# EAGLE schematic V0 (EAGLE 9.3.0)

## Sheet 1 of 10: ESP32 + CP2102N/USB + Antenna
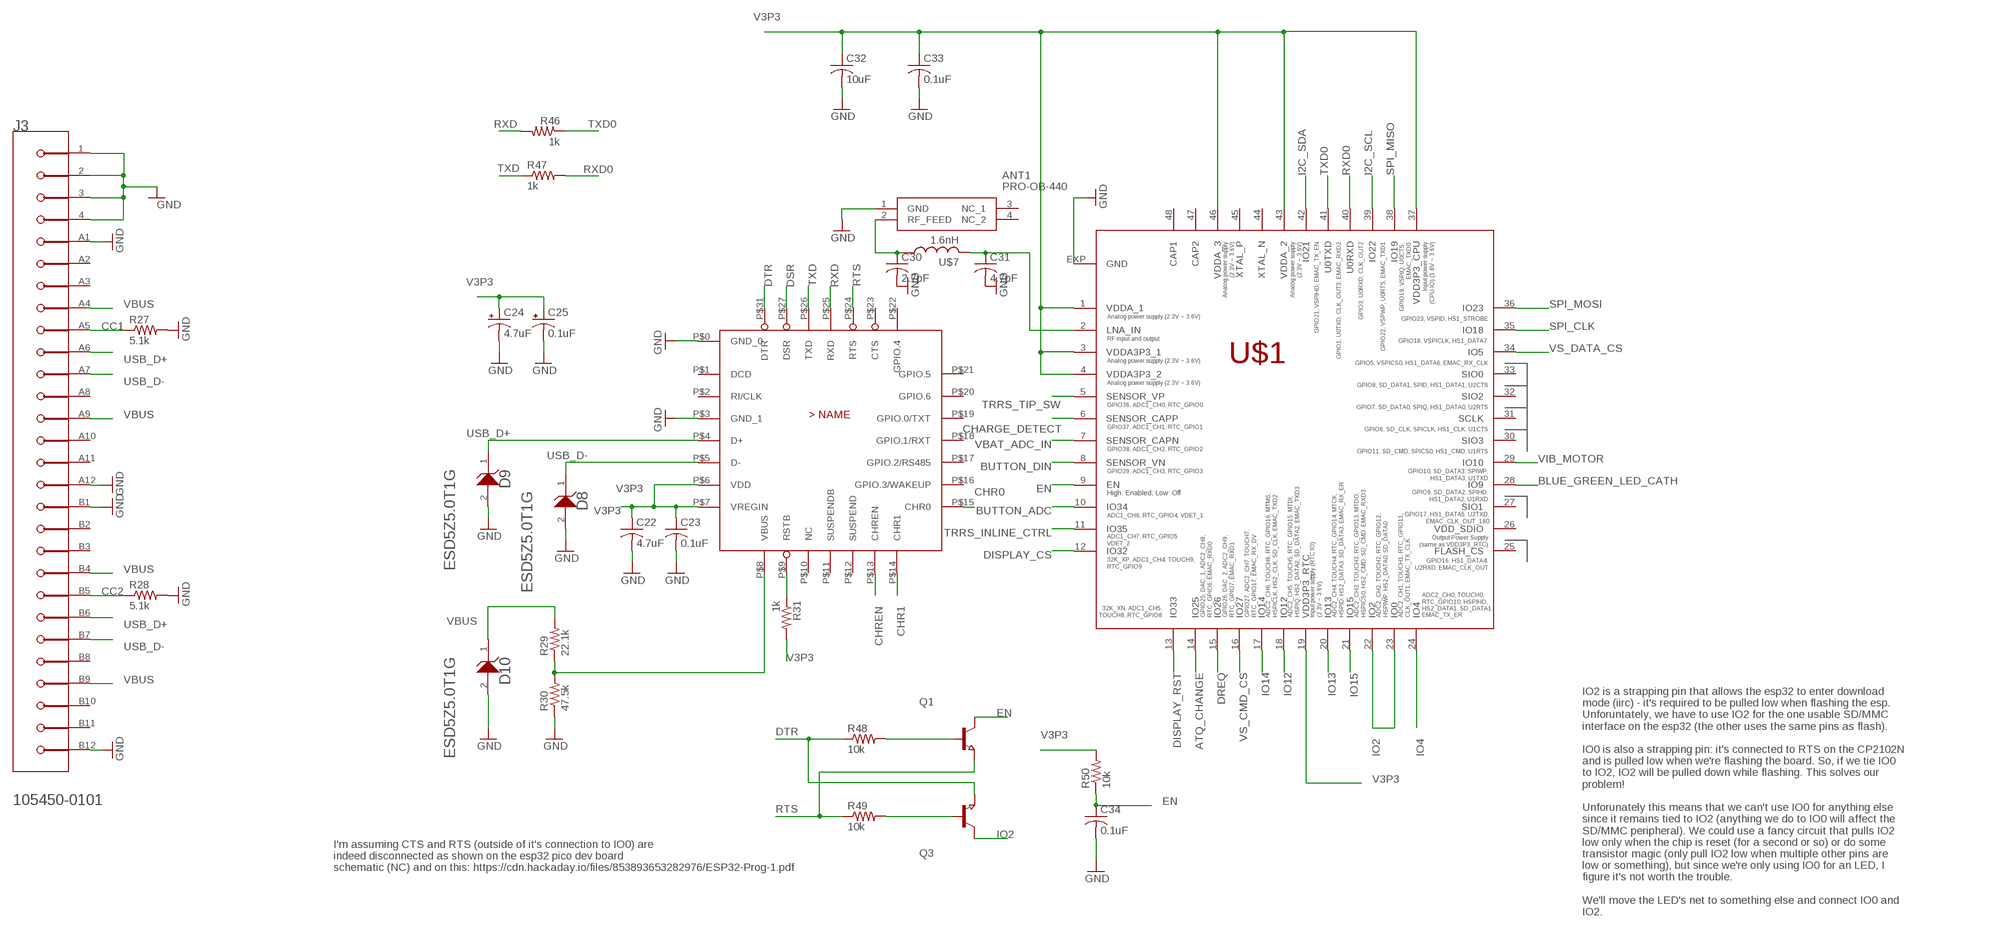
[diagram p0: schematic, sheet 1]

### Parts
ANT1  PRO-OB-440  [PRO-OB-440_1]
C22  4.7uF  C-USC0402  [C0402]
C23  0.1uF  C-USC0402  [C0402]
C24  4.7uF  CPOL-USC/6032-28R  [C/6032-28R]
C25  0.1uF  CPOL-USC/6032-28R  [C/6032-28R]
C30  2.7pF  C-USC0201  [C0201]
C31  4.7pF  C-USC0201  [C0201]
C32  10uF  C-USC0402  [C0402]
C33  0.1uF  C-USC0402  [C0402]
C34  0.1uF  C-USC1206  [C1206]
D8  ON_SEMICONDUCTOR_ESD5Z5.0T1GON_SEMICONDUCTOR_ESD5Z5.0T1G_0_0  [ON_SEMICONDUCTOR_ESD5Z5.0T1G_0]
D9  ON_SEMICONDUCTOR_ESD5Z5.0T1GON_SEMICONDUCTOR_ESD5Z5.0T1G_0_0  [ON_SEMICONDUCTOR_ESD5Z5.0T1G_0]
D10  ON_SEMICONDUCTOR_ESD5Z5.0T1GON_SEMICONDUCTOR_ESD5Z5.0T1G_0_0  [ON_SEMICONDUCTOR_ESD5Z5.0T1G_0]
J3  MOLEX_105450-0101MOLEX_105450-0101_0_0  [MOLEX_105450-0101_0]
JL  CP2102N-A02-GQFN28  [QFN28]
Q1  NPN-TRANSISTOR_SOT23  [SOT23]
Q3  NPN-TRANSISTOR_SOT23  [SOT23]
R27  5.1k  R-US_R0402  [R0402]
R28  5.1k  R-US_R0402  [R0402]
R29  22.1k  R-US_R0402  [R0402]
R30  47.5k  R-US_R0402  [R0402]
R31  1k  R-US_R0402  [R0402]
R46  1k  R-US_R0402  [R0402]
R47  1k  R-US_R0402  [R0402]
R48  10k  R-US_R0402  [R0402]
R49  10k  R-US_R0402  [R0402]
R50  10k  R-US_R0402  [R0402]
U$1  ESP32-PICO-D4  [QFN48]
U$7  1.6nH  L-0402  [R0402]

### Nets
ATQ_CHANGE: U$1.14(IO25) ; also sheet 6
BLUE_GREEN_LED_CATH: U$1.28(IO9) ; also sheet 10
BUTTON_ADC: U$1.10(IO34) ; also sheet 9
BUTTON_DIN: U$1.8(SENSOR_VN) ; also sheet 9
CHARGE_DETECT: U$1.6(SENSOR_CAPP) ; also sheet 10
CHR0: JL.P$15(CHR0)
CHR1: JL.P$14(CHR1)
CHREN: JL.P$13(CHREN)
CP_RSTB: JL.P$9(RSTB) R31.1
DISPLAY_CS: U$1.12(IO32) ; also sheet 4
DISPLAY_RST: U$1.13(IO33) ; also sheet 4
DREQ: U$1.15(IO26) ; also sheet 5
DSR: JL.P$27(DSR)
DTR: JL.P$31(DTR) Q3.2(E) R48.1
EN: C34.1 Q1.3(C) R50.1 U$1.9(EN)
GND: ANT1.1(GND) C22.2 C23.2 C24.- C25.- C30.2 C31.2 C32.2 C33.2 C34.2 D8.2(A) D9.2(A) D10.2(A) J3.1(MNT_1) J3.2(MNT_2) J3.3(MNT_3) J3.4(MNT_4) J3.A1(1_GND) J3.A12(2_GND) J3.B1(3_GND) J3.B12(4_GND) JL.P$0(GND_0) JL.P$3(GND_1) R27.2 R28.2 R30.1 U$1.EXP(GND) ; also sheet 2,3,4,5,6,7,8,9,10
I2C_SCL: U$1.39(IO22) ; also sheet 6
I2C_SDA: U$1.42(IO21) ; also sheet 6
IO2: Q3.3(C) U$1.22(IO2) U$1.23(IO0) ; also sheet 3
IO4: U$1.24(IO4) ; also sheet 3
IO12: U$1.18(IO12) ; also sheet 3
IO13: U$1.20(IO13) ; also sheet 3
IO14: U$1.17(IO14) ; also sheet 3
IO15: U$1.21(IO15) ; also sheet 3
N$30: ANT1.2(RF_FEED) C30.1 U$7.1
N$31: C31.1 U$1.2(LNA_IN) U$7.2
N$50: J3.A5(CC1) R27.1
N$51: J3.B5(CC2) R28.1
N$52: JL.P$8(VBUS) R29.1 R30.2
N$58: Q1.1(B) R48.2
N$59: Q3.1(B) R49.2
RTS: JL.P$24(RTS) Q1.2(E) R49.1
RXD: JL.P$25(RXD) R46.2
RXD0: R47.2 U$1.40(U0RXD)
SPI_CLK: U$1.35(IO18) ; also sheet 4,5
SPI_MISO: U$1.38(IO19) ; also sheet 4,5
SPI_MOSI: U$1.36(IO23) ; also sheet 4,5
TRRS_INLINE_CTRL: U$1.11(IO35) ; also sheet 5,10
TRRS_TIP_SW: U$1.5(SENSOR_VP) ; also sheet 5
TXD: JL.P$26(TXD) R47.1
TXD0: R46.1 U$1.41(U0TXD)
USB_D+: D9.1(K) J3.A6(1_D+) J3.B6(2_D+) JL.P$4(D+)
USB_D-: D8.1(K) J3.A7(1_D-) J3.B7(2_D-) JL.P$5(D-)
V3P3: C22.1 C23.1 C24.+ C25.+ C32.1 C33.1 JL.P$6(VDD) JL.P$7(VREGIN) R31.2 R50.2 U$1.1(VDDA_1) U$1.3(VDDA3P3_1) U$1.4(VDDA3P3_2) U$1.19(VDD3P3_RTC) U$1.37(VDD3P3_CPU) U$1.43(VDDA_2) U$1.46(VDDA_3) ; also sheet 2,3,4,5,6,9,10
VBAT_ADC_IN: U$1.7(SENSOR_CAPN) ; also sheet 10
VBUS: D10.1(K) J3.A4(1_VBUS) J3.A9(2_VBUS) J3.B4(3_VBUS) J3.B9(4_VBUS) R29.2 ; also sheet 2
VIB_MOTOR: U$1.29(IO10) ; also sheet 7
VS_CMD_CS: U$1.16(IO27) ; also sheet 5
VS_DATA_CS: U$1.34(IO5) ; also sheet 5
Unconnected: ANT1.3(NC_1) ANT1.4(NC_2) J3.A2(TX1+) J3.A3(TX1-) J3.A8(SBU1) J3.A10(RX2-) J3.A11(RX2+) J3.B2(TX2+) J3.B3(TX2-) J3.B8(SBU2) J3.B10(RX1-) J3.B11(RX1+) JL.P$1(DCD) JL.P$2(RI/CLK) JL.P$10(NC) JL.P$11(SUSPENDB) JL.P$12(SUSPEND) JL.P$16(GPIO.3/WAKEUP) JL.P$17(GPIO.2/RS485) JL.P$18(GPIO.1/RXT) JL.P$19(GPIO.0/TXT) JL.P$20(GPIO.6) JL.P$21(GPIO.5) JL.P$22(GPIO.4) JL.P$23(CTS) U$1.25(FLASH_CS) U$1.26(VDD_SDIO) U$1.27(SIO1) U$1.30(SIO3) U$1.31(SCLK) U$1.32(SIO2) U$1.33(SIO0) U$1.44(XTAL_N) U$1.45(XTAL_P) U$1.47(CAP2) U$1.48(CAP1)

### Notes on the sheet
- CC1
- CC2
- I'm assuming CTS and RTS (outside of it's connection to IO0) are
  indeed disconnected as shown on the esp32 pico dev board
  schematic (NC) and on this: https://cdn.hackaday.io/files/853893653282976/ESP32-Prog-1.pdf
- IO2 is a strapping pin that allows the esp32 to enter download
  mode (iirc) - it's required to be pulled low when flashing the esp.
  Unforuntately, we have to use IO2 for the one usable SD/MMC
  interface on the esp32 (the other uses the same pins as flash).
  
  IO0 is also a strapping pin: it's connected to RTS on the CP2102N
  and is pulled low when we're flashing the board. So, if we tie IO0
  to IO2, IO2 will be pulled down while flashing. This solves our
  problem!
  
  Unforunately this means that we can't use IO0 for anything else
  since it remains tied to IO2 (anything we do to IO0 will affect the
  SD/MMC peripheral). We could use a fancy circuit that pulls IO2
  low only when the chip is reset (for a second or so) or do some
  transistor magic (only pull IO2 low when multiple other pins are
  low or something), but since we're only using IO0 for an LED, I
  figure it's not worth the trouble.
  
  We'll move the LED's net to something else and connect IO0 and
  IO2.

## Sheet 2 of 10: Regulators + Charge IC
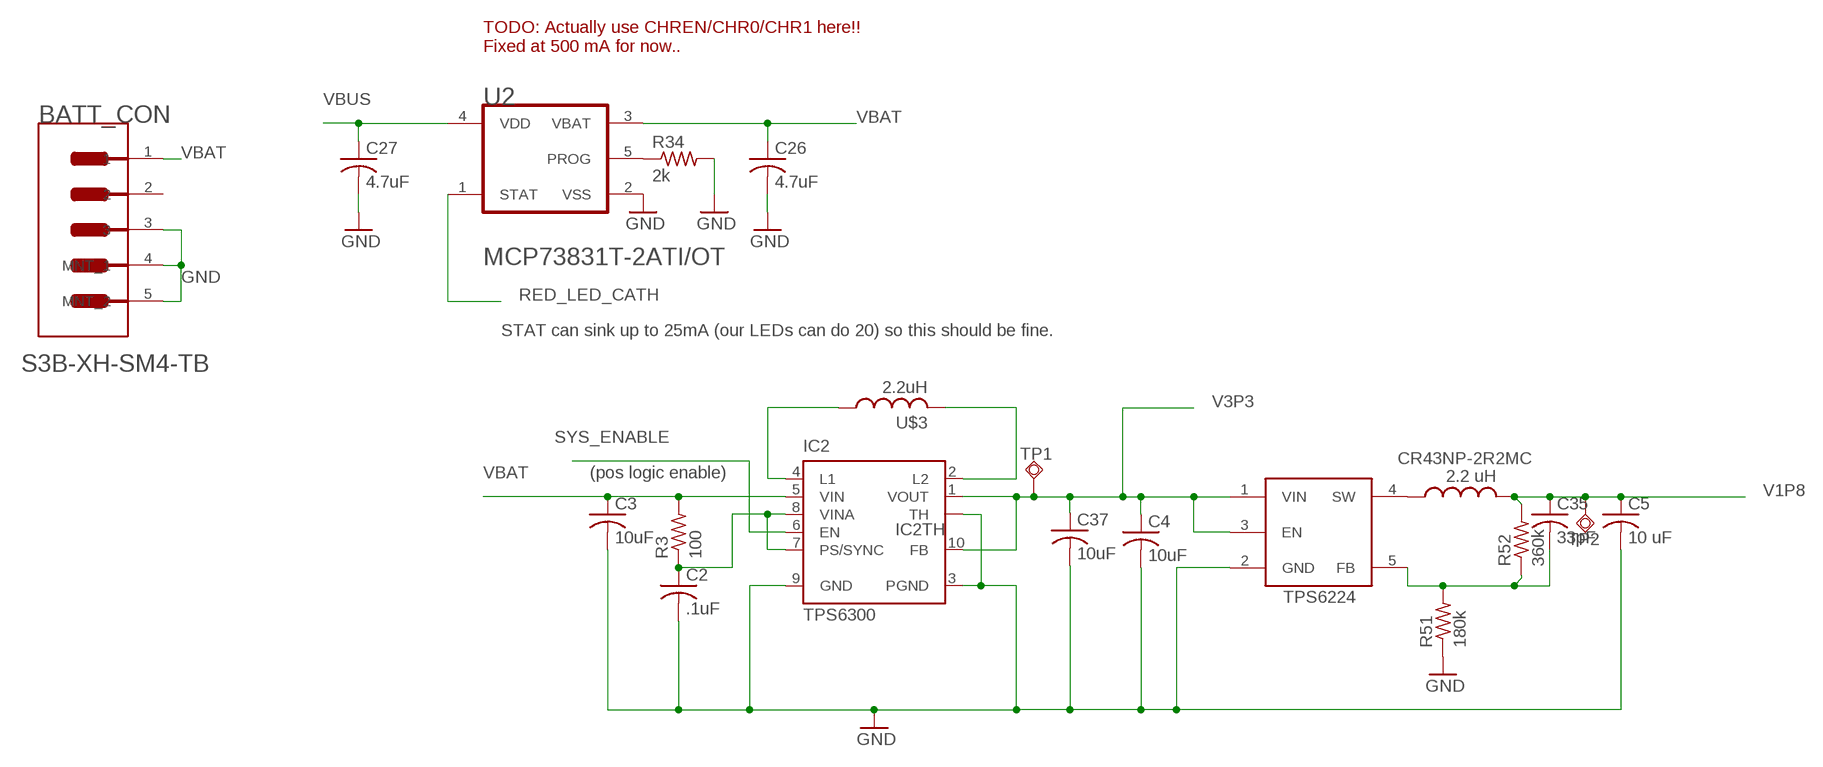
[diagram p1: schematic, sheet 2]

### Parts
BATT_CON  JST_S3B-XH-SM4-TBJST_S3B-XH-SM4-TB_0_0  [JST_S3B-XH-SM4-TB_0]
C2  .1uF  C-USC0402  [C0402]
C3  10uF  C-USC0402  [C0402]
C4  10uF  C-USC0402  [C0402]
C5  10 uF  C-USC0402  [C0402]
C26  4.7uF  C-USC0402  [C0402]
C27  4.7uF  C-USC0402  [C0402]
C35  33pF  C-USC0402  [C0402]
C37  10uF  C-USC0402  [C0402]
IC2  TPS6300  [DRC-S-PVSON-N10]
R3  100  R-US_R0402  [R0402]
R34  2k  R-US_R0402  [R0402]
R51  180k  R-US_R0402  [R0402]
R52  360k  R-US_R0402  [R0402]
TP1  TPSQTP15SQ  [TP15SQ]
TP2  TPSQTP15SQ  [TP15SQ]
TPS6224  TPS62240  [TSP62240]
U2  MICROCHIP_MCP73831T-2ATI-OTMICROCHIP_MCP73831T-2ATI-OT_0_1  [MICROCHIP_MCP73831T-2ATI-OT_1]
U$3  2.2uH  VLS4012  [INDUCTOR]
U$5  CR43NP-2R2MC  [INDUCTOR]

### Nets
GND: BATT_CON.3 BATT_CON.4(MNT_1) BATT_CON.5(MNT_2) C2.2 C3.2 C4.2 C5.2 C26.2 C27.2 C37.2 IC2.3(PGND) IC2.9(GND) IC2.TH R34.2 R51.1 TPS6224.2(GND) U2.2(VSS) ; also sheet 1,3,4,5,6,7,8,9,10
N$3: C2.1 IC2.7(PS/SYNC) IC2.8(VINA) R3.1
N$6: IC2.2(L2) U$3.P$2
N$8: IC2.4(L1) U$3.P$1
N$10: TPS6224.4(SW) U$5.P$1
N$42: C35.2 R51.2 R52.1 TPS6224.5(FB)
N$54: R34.1 U2.5(PROG)
RED_LED_CATH: U2.1(STAT) ; also sheet 10
SYS_ENABLE: IC2.6(EN) ; also sheet 8
V1P8: C5.1 C35.1 R52.2 TP2.TP U$5.P$2 ; also sheet 5
V3P3: C4.1 C37.1 IC2.1(VOUT) IC2.10(FB) TP1.TP TPS6224.1(VIN) TPS6224.3(EN) ; also sheet 1,3,4,5,6,9,10
VBAT: BATT_CON.1 C3.1 C26.1 IC2.5(VIN) R3.2 U2.3(VBAT) ; also sheet 7,8,10
VBUS: C27.1 U2.4(VDD) ; also sheet 1
Unconnected: BATT_CON.2

### Notes on the sheet
- TODO: Actually use CHREN/CHR0/CHR1 here!!
  Fixed at 500 mA for now..
- STAT can sink up to 25mA (our LEDs can do 20) so this should be fine.
- (pos logic enable)
- TPS6224

## Sheet 3 of 10: microSD
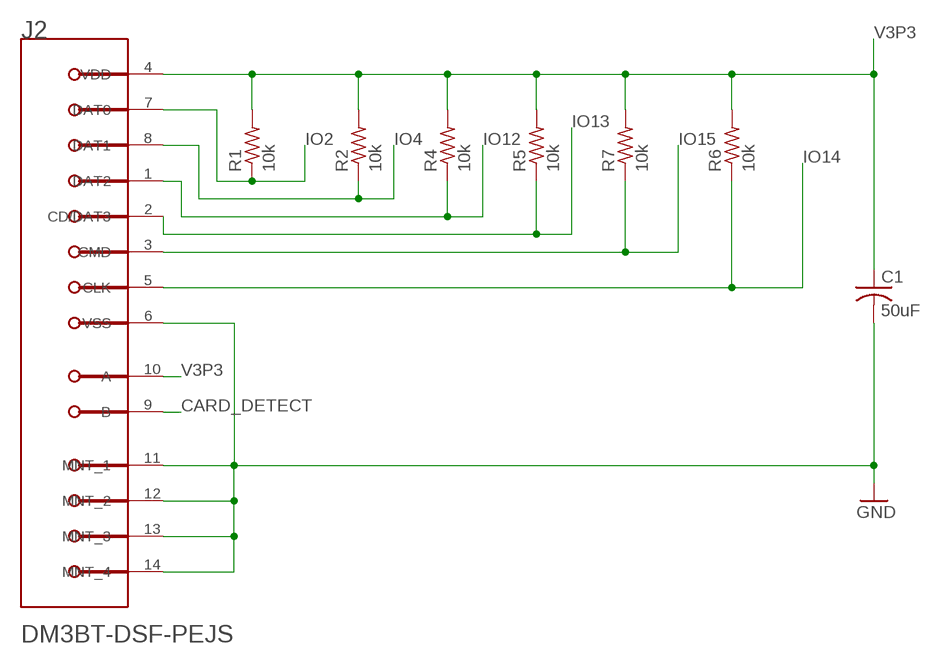
[diagram p2: schematic, sheet 3]

### Parts
C1  50uF  C-USC0402  [C0402]
J2  HIROSE_DM3BT-DSF-PEJSHIROSE_DM3BT-DSF-PEJS_0_0  [HIROSE_DM3BT-DSF-PEJS_0]
R1  10k  R-US_R0402  [R0402]
R2  10k  R-US_R0402  [R0402]
R4  10k  R-US_R0402  [R0402]
R5  10k  R-US_R0402  [R0402]
R6  10k  R-US_R0402  [R0402]
R7  10k  R-US_R0402  [R0402]

### Nets
CARD_DETECT: J2.9(B) ; also sheet 9
GND: C1.2 J2.6(VSS) J2.11(MNT_1) J2.12(MNT_2) J2.13(MNT_3) J2.14(MNT_4) ; also sheet 1,2,4,5,6,7,8,9,10
IO2: J2.7(DAT0) R1.1 ; also sheet 1
IO4: J2.8(DAT1) R2.1 ; also sheet 1
IO12: J2.1(DAT2) R4.1 ; also sheet 1
IO13: J2.2(CD/DAT3) R5.1 ; also sheet 1
IO14: J2.5(CLK) R6.1 ; also sheet 1
IO15: J2.3(CMD) R7.1 ; also sheet 1
V3P3: C1.1 J2.4(VDD) J2.10(A) R1.2 R2.2 R4.2 R5.2 R6.2 R7.2 ; also sheet 1,2,4,5,6,9,10

## Sheet 4 of 10: Display
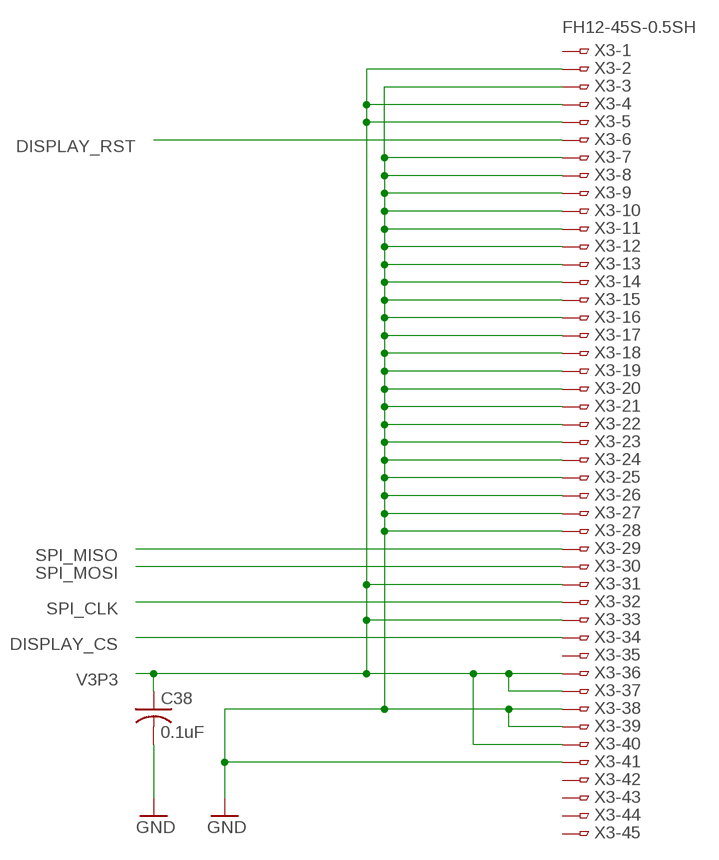
[diagram p3: schematic, sheet 4]

### Parts
C38  0.1uF  C-USC0402  [C0402]
X3  FH12-45S-0.5SH  [FH12-45S-0.5SH]

### Nets
DISPLAY_CS: X3.34 ; also sheet 1
DISPLAY_RST: X3.6 ; also sheet 1
GND: C38.2 X3.3 X3.7 X3.8 X3.9 X3.10 X3.11 X3.12 X3.13 X3.14 X3.15 X3.16 X3.17 X3.18 X3.19 X3.20 X3.21 X3.22 X3.23 X3.24 X3.25 X3.26 X3.27 X3.28 X3.38 X3.39 X3.41 ; also sheet 1,2,3,5,6,7,8,9,10
SPI_CLK: X3.32 ; also sheet 1,5
SPI_MISO: X3.29 ; also sheet 1,5
SPI_MOSI: X3.30 ; also sheet 1,5
V3P3: C38.1 X3.2 X3.4 X3.5 X3.31 X3.33 X3.36 X3.37 X3.40 ; also sheet 1,2,3,5,6,9,10
Unconnected: X3.1 X3.35 X3.42 X3.43 X3.44 X3.45

## Sheet 5 of 10: VS1053 + Headphone Jack
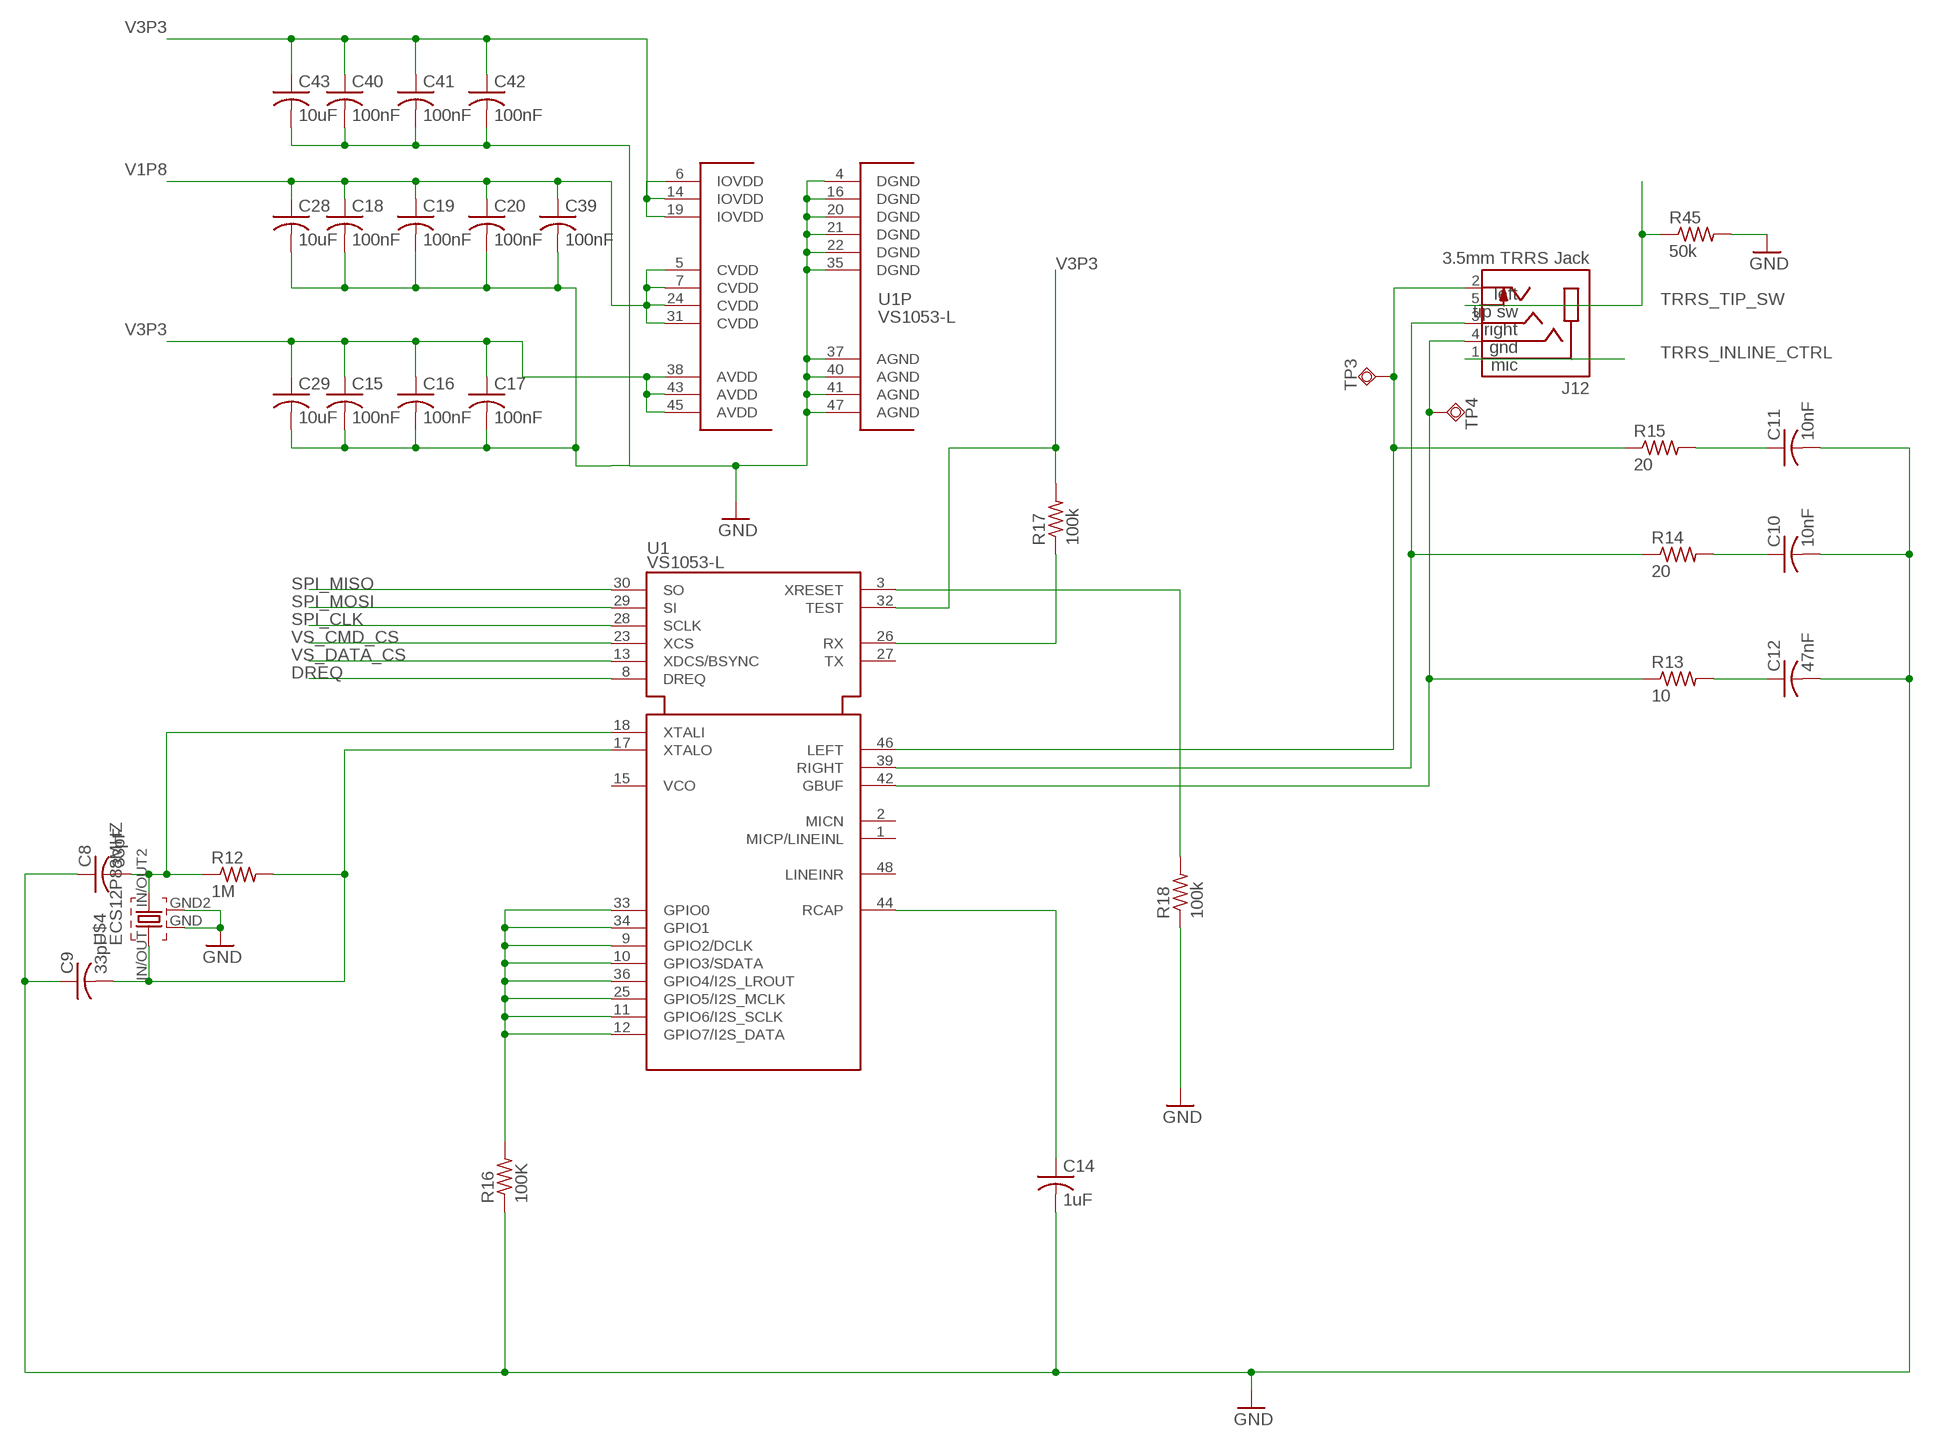
[diagram p4: schematic, sheet 5]

### Parts
C8  33pF  C-USC0402  [C0402]
C9  33pF  C-USC0402  [C0402]
C10  10nF  C-USC0402  [C0402]
C11  10nF  C-USC0402  [C0402]
C12  47nF  C-USC0402  [C0402]
C14  1uF  C-USC0402  [C0402]
C15  100nF  C-USC0402  [C0402]
C16  100nF  C-USC0402  [C0402]
C17  100nF  C-USC0402  [C0402]
C18  100nF  C-USC0402  [C0402]
C19  100nF  C-USC0402  [C0402]
C20  100nF  C-USC0402  [C0402]
C28  10uF  C-USC0402  [C0402]
C29  10uF  C-USC0402  [C0402]
C39  100nF  C-USC0402  [C0402]
C40  100nF  C-USC0402  [C0402]
C41  100nF  C-USC0402  [C0402]
C42  100nF  C-USC0402  [C0402]
C43  10uF  C-USC0402  [C0402]
J12  3.5mm TRRS Jack  SJ-43515TS-SMT  [CUI_SJ-43515TS-SMT]
R12  1M  R-US_R0402  [R0402]
R13  10  R-US_R0402  [R0402]
R14  20  R-US_R0402  [R0402]
R15  20  R-US_R0402  [R0402]
R16  100K  R-US_R0402  [R0402]
R17  100k  R-US_R0402  [R0402]
R18  100k  R-US_R0402  [R0402]
R45  50k  R-US_R0402  [R0402]
TP3  TPSQTP15SQ  [TP15SQ]
TP4  TPSQTP15SQ  [TP15SQ]
U1  VS1053-L  [LQFP48]
U$4  ECS12P88MHZ  [ECSCRYSTAL]

### Nets
DREQ: U1.8(DREQ) ; also sheet 1
GND: C8.1 C9.1 C10.2 C11.2 C12.2 C14.2 C15.2 C16.2 C17.2 C18.2 C19.2 C20.2 C28.2 C29.2 C39.2 C40.2 C41.2 C42.2 C43.2 R16.1 R18.1 R45.2 U1.4(DGND) U1.16(DGND) U1.20(DGND) U1.21(DGND) U1.22(DGND) U1.35(DGND) U1.37(AGND) U1.40(AGND) U1.41(AGND) U1.47(AGND) U$4.GND U$4.GND2 ; also sheet 1,2,3,4,6,7,8,9,10
N$4: C8.2 R12.1 U1.18(XTALI) U$4.IN/OUT2
N$21: C9.2 R12.2 U1.17(XTALO) U$4.IN/OUT
N$27: R17.1 U1.26(RX)
N$34: C12.1 R13.2
N$35: C10.1 R14.2
N$36: C11.1 R15.2
N$38: R16.2 U1.9(GPIO2/DCLK) U1.10(GPIO3/SDATA) U1.11(GPIO6/I2S_SCLK) U1.12(GPIO7/I2S_DATA) U1.25(GPIO5/I2S_MCLK) U1.33(GPIO0) U1.34(GPIO1) U1.36(GPIO4/I2S_LROUT)
N$39: C14.1 U1.44(RCAP)
N$41: R18.2 U1.3(XRESET)
N$48: J12.4(RING2) R13.1 TP4.TP U1.42(GBUF)
N$49: J12.3(RING1) R14.1 U1.39(RIGHT)
N$57: J12.2(TIP) R15.1 TP3.TP U1.46(LEFT)
SPI_CLK: U1.28(SCLK) ; also sheet 1,4
SPI_MISO: U1.30(SO) ; also sheet 1,4
SPI_MOSI: U1.29(SI) ; also sheet 1,4
TRRS_INLINE_CTRL: J12.1(SLEEVE) ; also sheet 1,10
TRRS_TIP_SW: J12.5(TIP_SWITCH) R45.1 ; also sheet 1
V1P8: C18.1 C19.1 C20.1 C28.1 C39.1 U1.5(CVDD) U1.7(CVDD) U1.24(CVDD) U1.31(CVDD) ; also sheet 2
V3P3: C15.1 C16.1 C17.1 C29.1 C40.1 C41.1 C42.1 C43.1 R17.2 U1.6(IOVDD) U1.14(IOVDD) U1.19(IOVDD) U1.32(TEST) U1.38(AVDD) U1.43(AVDD) U1.45(AVDD) ; also sheet 1,2,3,4,6,9,10
VS_CMD_CS: U1.23(XCS) ; also sheet 1
VS_DATA_CS: U1.13(XDCS/BSYNC) ; also sheet 1
Unconnected: U1.1(MICP/LINEINL) U1.2(MICN) U1.15(VCO) U1.27(TX) U1.48(LINEINR)

## Sheet 6 of 10: Clickwheel
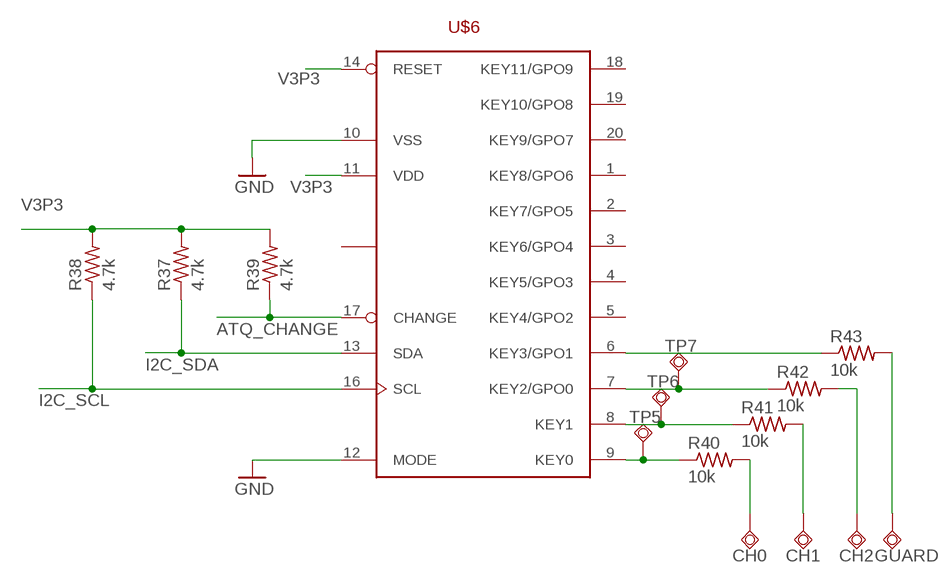
[diagram p5: schematic, sheet 6]

### Parts
CH0  TPSQTP20SQ  [TP20SQ]
CH1  TPSQTP20SQ  [TP20SQ]
CH2  TPSQTP20SQ  [TP20SQ]
GUARD  TPSQTP20SQ  [TP20SQ]
R37  4.7k  R-US_R0402  [R0402]
R38  4.7k  R-US_R0402  [R0402]
R39  4.7k  R-US_R0402  [R0402]
R40  10k  R-US_R0402  [R0402]
R41  10k  R-US_R0402  [R0402]
R42  10k  R-US_R0402  [R0402]
R43  10k  R-US_R0402  [R0402]
TP5  TPSQTP15SQ  [TP15SQ]
TP6  TPSQTP15SQ  [TP15SQ]
TP7  TPSQTP15SQ  [TP15SQ]
U$6  COMMS-AT42QT2120XU  [TSSOP20]

### Nets
ATQ_CHANGE: R39.1 U$6.17(CHANGE) ; also sheet 1
GND: U$6.10(VSS) U$6.12(MODE) ; also sheet 1,2,3,4,5,7,8,9,10
I2C_SCL: R38.1 U$6.16(SCL) ; also sheet 1
I2C_SDA: R37.1 U$6.13(SDA) ; also sheet 1
N$11: R40.1 TP5.TP U$6.9(KEY0)
N$18: CH1.TP R41.2
N$20: CH2.TP R42.2
N$23: R41.1 TP6.TP U$6.8(KEY1)
N$25: R42.1 TP7.TP U$6.7(KEY2/GPO0)
N$26: R43.1 U$6.6(KEY3/GPO1)
N$37: CH0.TP R40.2
N$40: GUARD.TP R43.2
V3P3: R37.2 R38.2 R39.2 U$6.11(VDD) U$6.14(RESET) ; also sheet 1,2,3,4,5,9,10
Unconnected: U$6.1(KEY8/GPO6) U$6.2(KEY7/GPO5) U$6.3(KEY6/GPO4) U$6.4(KEY5/GPO3) U$6.5(KEY4/GPO2) U$6.15(NC) U$6.18(KEY11/GPO9) U$6.19(KEY10/GPO8) U$6.20(KEY9/GPO7)

## Sheet 7 of 10: Vibration Motor
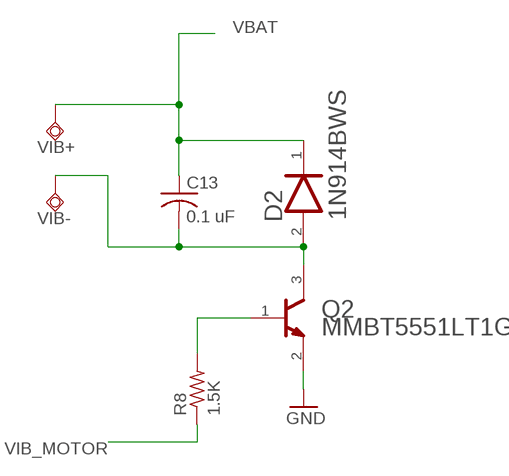
[diagram p6: schematic, sheet 7]

### Parts
C13  0.1 uF  C-USC0402  [C0402]
D2  ON_SEMI_1N914BWSON_SEMI_1N914BWS_0_0  [ON_SEMI_1N914BWS_0]
Q2  ON_SEMI_MMBT5551LT1GON_SEMI_MMBT5551LT1G_0_0  [ON_SEMI_MMBT5551LT1G_0]
R8  1.5K  R-US_R0402  [R0402]
VIB+  TPSQTP20SQ  [TP20SQ]
VIB-  TPSQTP20SQ  [TP20SQ]

### Nets
GND: Q2.2(EMITTER) ; also sheet 1,2,3,4,5,6,8,9,10
N$1: C13.2 D2.2(ANODE) Q2.3(COLLECTOR) VIB-.TP
N$22: Q2.1(BASE) R8.2
VBAT: C13.1 D2.1(CATHODE) VIB+.TP ; also sheet 2,8,10
VIB_MOTOR: R8.1 ; also sheet 1

## Sheet 8 of 10: Power On/Power Off
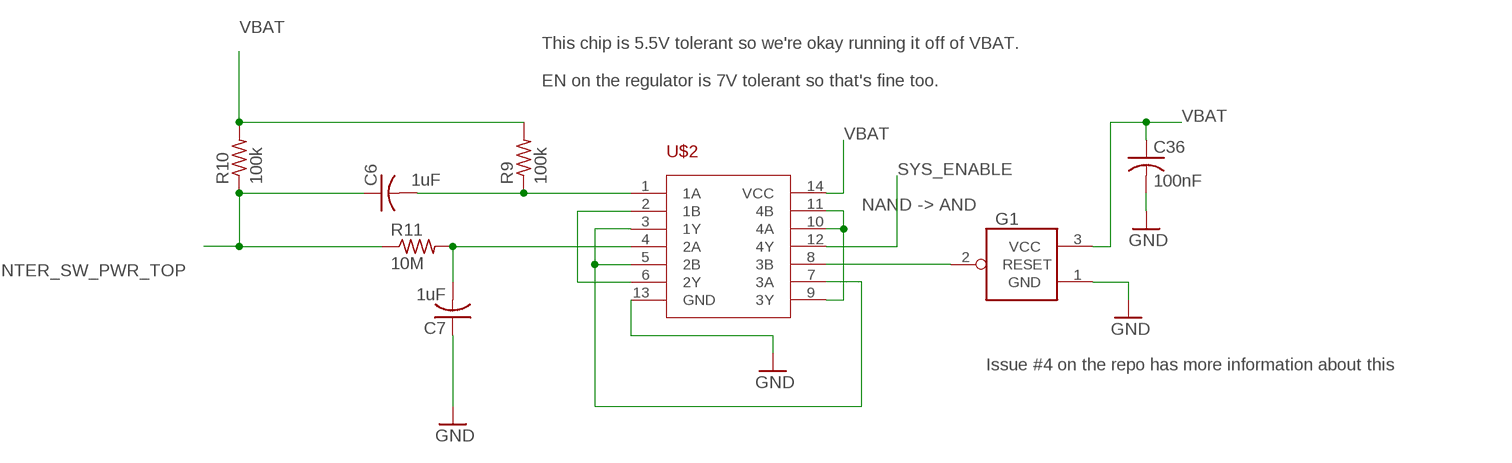
[diagram p7: schematic, sheet 8]

### Parts
C6  1uF  C-USC0402  [C0402]
C7  1uF  C-USC0402  [C0402]
C36  100nF  C-USC0402  [C0402]
G1  APX809S-31SA  [SOT23]
R9  100k  R-US_R0402  [R0402]
R10  100k  R-US_R0402  [R0402]
R11  10M  R-US_R0402  [R0402]
U$2  TOSHIBA-NAND-GATE  [TSSOP14]

### Nets
CENTER_SW_PWR_TOP: C6.1 R10.1 R11.1 ; also sheet 9
GND: C7.1 C36.2 G1.1(GND) U$2.13(GND) ; also sheet 1,2,3,4,5,6,7,9,10
N$5: C6.2 R9.1 U$2.1(1A)
N$12: U$2.3(1Y) U$2.5(2B) U$2.7(3A)
N$14: C7.2 R11.2 U$2.4(2A)
N$19: U$2.2(1B) U$2.6(2Y)
N$33: U$2.9(3Y) U$2.10(4A) U$2.11(4B)
N$43: G1.2(RESET) U$2.8(3B)
SYS_ENABLE: U$2.12(4Y) ; also sheet 2
VBAT: C36.1 G1.3(VCC) R9.2 R10.2 U$2.14(VCC) ; also sheet 2,7,10

### Notes on the sheet
- This chip is 5.5V tolerant so we're okay running it off of VBAT.
  
  EN on the regulator is 7V tolerant so that's fine too.
- NAND -> AND
- Issue #4 on the repo has more information about this

## Sheet 9 of 10: Buttons
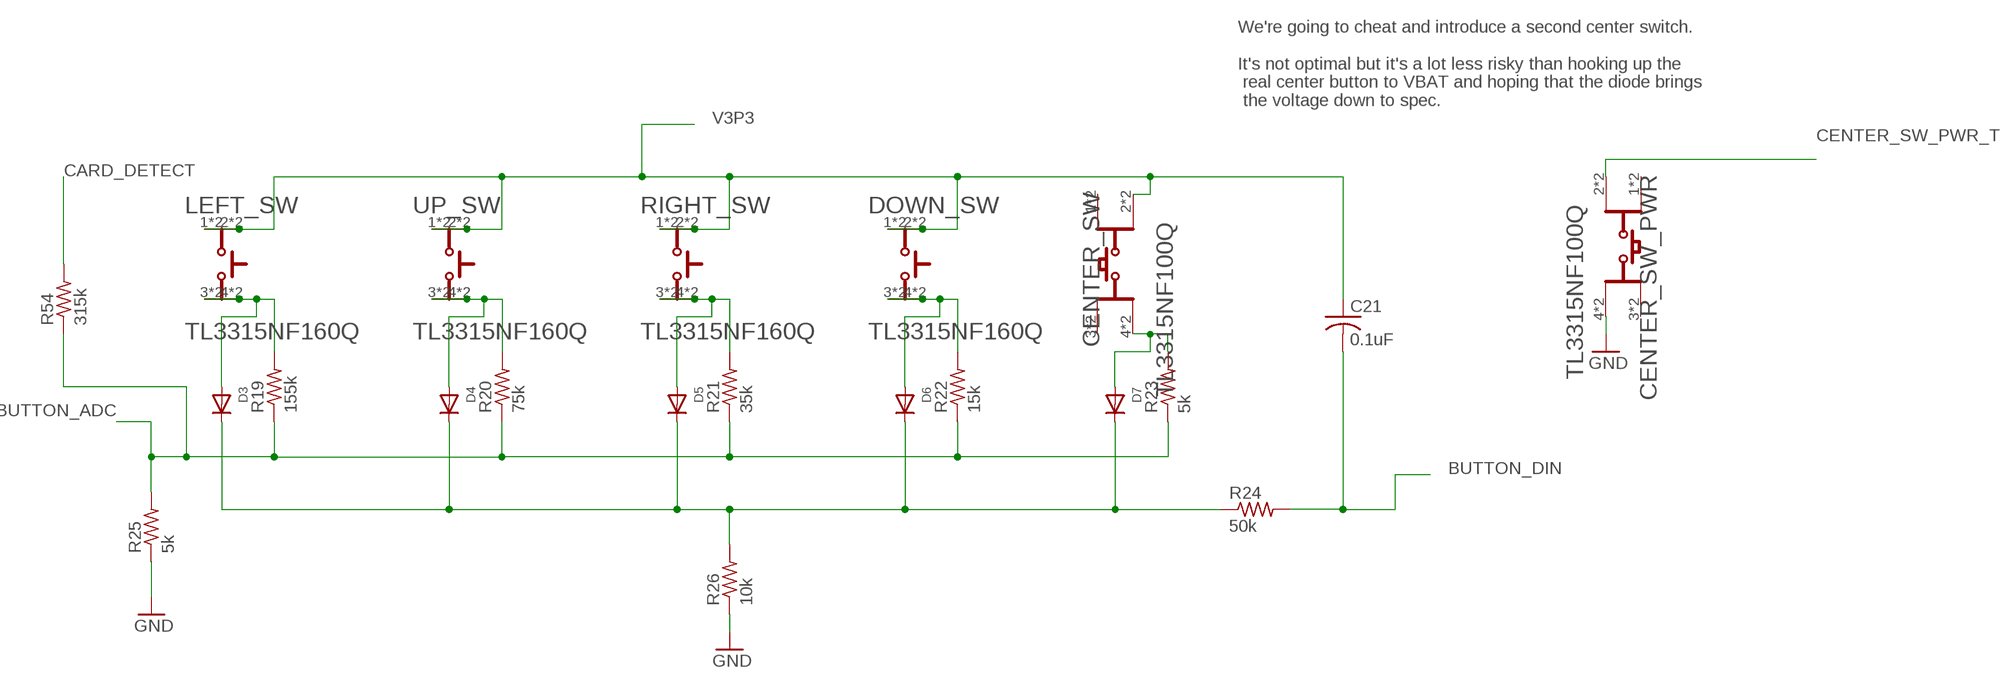
[diagram p8: schematic, sheet 9]

### Parts
C21  0.1uF  C-USC0402  [C0402]
CENTER_SW  E-SWITCH_TL3315NF100QE-SWITCH_TL3315NF100Q_0_0  [E-SWITCH_TL3315NF100Q_0]
CENTER_SW_PWR  E-SWITCH_TL3315NF100QE-SWITCH_TL3315NF100Q_0_0  [E-SWITCH_TL3315NF100Q_0]
D3  DIODESOD-523  [SOD-523]
D4  DIODESOD-523  [SOD-523]
D5  DIODESOD-523  [SOD-523]
D6  DIODESOD-523  [SOD-523]
D7  DIODESOD-523  [SOD-523]
DOWN_SW  E-SWITCH_TL3315NF160QE-SWITCH_TL3315NF160Q_0_0  [E-SWITCH_TL3315NF160Q_0]
LEFT_SW  E-SWITCH_TL3315NF160QE-SWITCH_TL3315NF160Q_0_0  [E-SWITCH_TL3315NF160Q_0]
R19  155k  R-US_R0402  [R0402]
R20  75k  R-US_R0402  [R0402]
R21  35k  R-US_R0402  [R0402]
R22  15k  R-US_R0402  [R0402]
R23  5k  R-US_R0402  [R0402]
R24  50k  R-US_R0402  [R0402]
R25  5k  R-US_R0402  [R0402]
R26  10k  R-US_R0402  [R0402]
R54  315k  R-US_R0402  [R0402]
RIGHT_SW  E-SWITCH_TL3315NF160QE-SWITCH_TL3315NF160Q_0_0  [E-SWITCH_TL3315NF160Q_0]
UP_SW  E-SWITCH_TL3315NF160QE-SWITCH_TL3315NF160Q_0_0  [E-SWITCH_TL3315NF160Q_0]

### Nets
BUTTON_ADC: R19.1 R20.1 R21.1 R22.1 R23.1 R25.2 R54.1 ; also sheet 1
BUTTON_DIN: C21.2 R24.2 ; also sheet 1
CARD_DETECT: R54.2 ; also sheet 3
CENTER_SW_PWR_TOP: CENTER_SW_PWR.2 CENTER_SW_PWR.2-2 ; also sheet 8
GND: CENTER_SW_PWR.4 CENTER_SW_PWR.4-2 R25.1 R26.1 ; also sheet 1,2,3,4,5,6,7,8,10
N$16: D4.A R20.2 UP_SW.3 UP_SW.3-2 UP_SW.4 UP_SW.4-2
N$24: D5.A R21.2 RIGHT_SW.3 RIGHT_SW.3-2 RIGHT_SW.4 RIGHT_SW.4-2
N$28: D6.A DOWN_SW.3 DOWN_SW.3-2 DOWN_SW.4 DOWN_SW.4-2 R22.2
N$29: CENTER_SW.4 CENTER_SW.4-2 D7.A R23.2
N$32: D3.K(C) D4.K(C) D5.K(C) D6.K(C) D7.K(C) R24.1 R26.2
N$46: D3.A LEFT_SW.3 LEFT_SW.3-2 LEFT_SW.4 LEFT_SW.4-2 R19.2
V3P3: C21.1 CENTER_SW.2 CENTER_SW.2-2 DOWN_SW.1 DOWN_SW.1-2 DOWN_SW.2 DOWN_SW.2-2 LEFT_SW.1 LEFT_SW.1-2 LEFT_SW.2 LEFT_SW.2-2 RIGHT_SW.1 RIGHT_SW.1-2 RIGHT_SW.2 RIGHT_SW.2-2 UP_SW.1 UP_SW.1-2 UP_SW.2 UP_SW.2-2 ; also sheet 1,2,3,4,5,6,10
Unconnected: CENTER_SW.1 CENTER_SW.1-2 CENTER_SW.3 CENTER_SW.3-2 CENTER_SW_PWR.1 CENTER_SW_PWR.1-2 CENTER_SW_PWR.3 CENTER_SW_PWR.3-2

### Notes on the sheet
- We're going to cheat and introduce a second center switch. 
  
  It's not optimal but it's a lot less risky than hooking up the
   real center button to VBAT and hoping that the diode brings
   the voltage down to spec.

## Sheet 10 of 10: Misc (Line In Controls, LED, Battery Voltage)
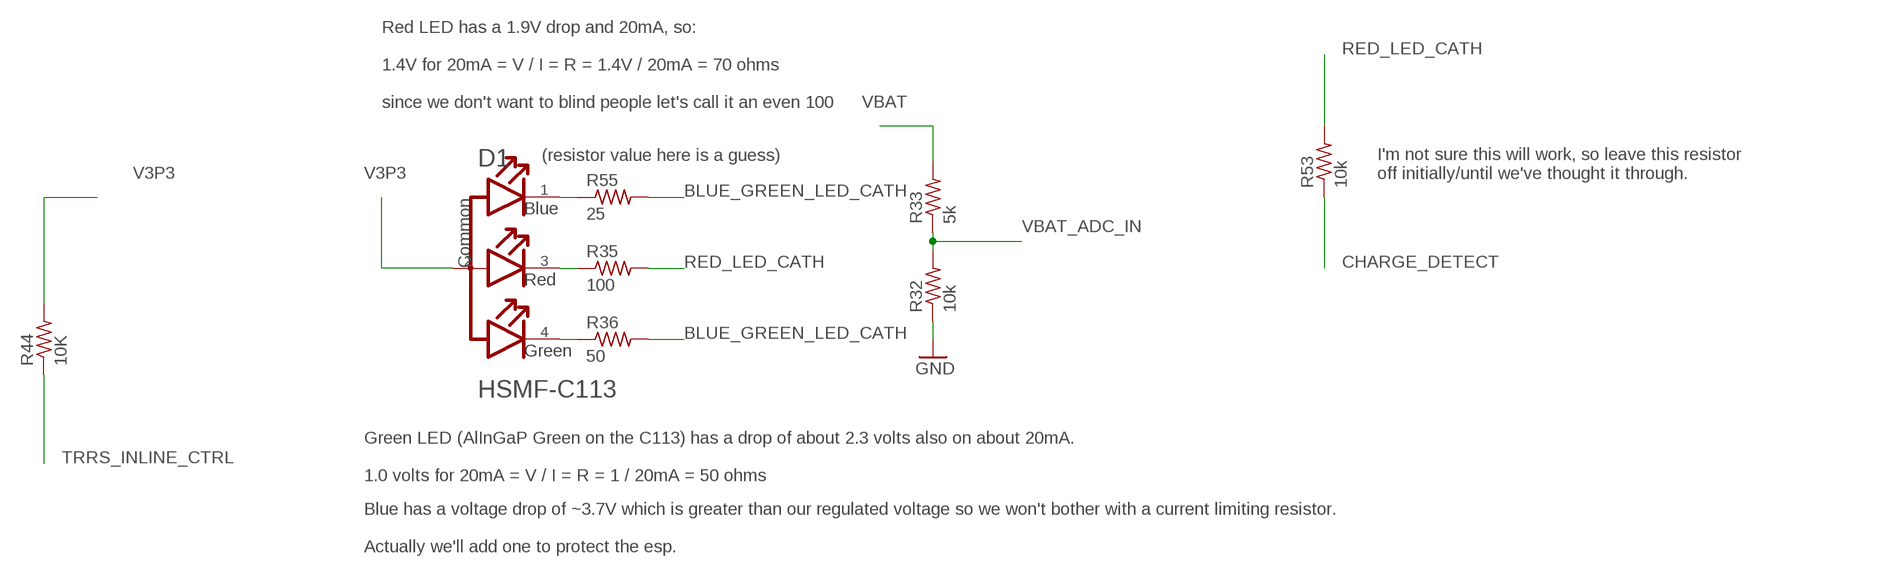
[diagram p9: schematic, sheet 10]

### Parts
D1  BROADCOM_HSMF-C113BROADCOM_HSMF-C113_0_0  [BROADCOM_HSMF-C113_0]
R32  10k  R-US_R0402  [R0402]
R33  5k  R-US_R0402  [R0402]
R35  100  R-US_R0402  [R0402]
R36  50  R-US_R0402  [R0402]
R44  10K  R-US_R0402  [R0402]
R53  10k  R-US_R0402  [R0402]
R55  25  R-US_R0402  [R0402]

### Nets
BLUE_GREEN_LED_CATH: R36.2 R55.2 ; also sheet 1
CHARGE_DETECT: R53.1 ; also sheet 1
GND: R32.1 ; also sheet 1,2,3,4,5,6,7,8,9
N$2: D1.1(BLUE_CATHODE) R55.1
N$55: D1.3(RED_CATHODE) R35.1
N$56: D1.4(GREEN_CATHODE) R36.1
RED_LED_CATH: R35.2 R53.2 ; also sheet 2
TRRS_INLINE_CTRL: R44.1 ; also sheet 1,5
V3P3: D1.2(COMMON_ANODE) R44.2 ; also sheet 1,2,3,4,5,6,9
VBAT: R33.2 ; also sheet 2,7,8
VBAT_ADC_IN: R32.2 R33.1 ; also sheet 1

### Notes on the sheet
- Red LED has a 1.9V drop and 20mA, so:
  
  1.4V for 20mA = V / I = R = 1.4V / 20mA = 70 ohms
  
  since we don't want to blind people let's call it an even 100
- (resistor value here is a guess)
- I'm not sure this will work, so leave this resistor
  off initially/until we've thought it through.
- Green LED (AlInGaP Green on the C113) has a drop of about 2.3 volts also on about 20mA.
  
  1.0 volts for 20mA = V / I = R = 1 / 20mA = 50 ohms
- Blue has a voltage drop of ~3.7V which is greater than our regulated voltage so we won't bother with a current limiting resistor.
  
  Actually we'll add one to protect the esp.

## Library data of the parts
ANT1 = PRO-OB-440:PRO-OB-440: OnBoard SMD 2400 antenna Source: Datasheet <http://www.proant.se/files/user/Datasheet - OnBoard SMD 2400 MHz rev 2.0.pdf>; DESCRIPTION: OnBoard SMD 2400 antenna; HEIGHT: mm; MANUFACTURER_NAME: Proant AB; MANUFACTURER_PART_NUMBER: PRO-OB-440
BATT_CON = JST-S3B-XH-SM4-TB:JST_S3B-XH-SM4-TB: 2.5mm pitch/ Disconnectable Crimp style connectors; CENTROID_NOT_SPECIFIED: No; CURRENT: 3.0A; DATASHEET: https://upverter.com/datasheet/d0ef474b08262649b2e88d8de799d1feabfec59e.pdf; DIGIKEY_DESCRIPTION: CONN HEADER XH SMD 3POS 2.5MM; DIGIKEY_PART_NUMBER: 455-2263-1-ND; IMPORTED_FROM: octopart; LEAD_FREE: yes; MF: JST; MPN: S3B-XH-SM4-TB; NUM_PINS: 3; OCTOPART_PART_NUMBER: a0e069d6672e7f27; PACKAGE: HDR3; PREFIX: J; ROHS: yes; TEMPERATURE_RANGE_HIGH: +85°C; TEMPERATURE_RANGE_LOW: -25°C; VOLTAGE: 250V
C1-C23 C26-C43 = rcl:C-US: CAPACITOR, American symbol; SPICEPREFIX: C
C24 C25 = rcl:CPOL-US: POLARIZED CAPACITOR, American symbol; SPICEPREFIX: C
CENTER_SW CENTER_SW_PWR = E-Switch-TL3315NF100Q:E-SWITCH_TL3315NF100Q: SWITCH TACTILE SPST; CENTROID_NOT_SPECIFIED: No; CIRCUIT: SPST-NO; CONTACT_RATING_@_VOLTAGE: 0.05A @ 15VDC; DATASHEET: http://spec_sheets.e-switch.com/specs/P010336.pdf; DIGIKEY_DESCRIPTION: SWITCH Tactile Switch SPST-NO Top Actuated Surface Mount; DIGIKEY_PART_NUMBER: EG4620CT-ND; LEAD_FREE: yes; MF: E-Switch; MOUSER_PART_NUMBER: 612-TL3315NF100Q; MPN: TL3315NF100Q; PACKAGE: SMT_4POS; PREFIX: SW; ROHS: yes; TEMPERATURE_RANGE_HIGH: +70°C; TEMPERATURE_RANGE_LOW: -20°C
CH0 CH1 CH2 GUARD TP1-TP7 VIB+ VIB- = testpad:TPSQ: Test pad
D1 = Broadcom-HSMF-C113:BROADCOM_HSMF-C113: Right Angle Tricolor Surface Mount ChipLED; CENTROID_NOT_SPECIFIED: Yes; DATASHEET: https://docs.broadcom.com/docs/AV02-0611EN; DC_FORWARD_CURRENT: 20mA; DIGIKEY_DESCRIPTION: DIODE Red, Green, Blue (RGB) 626nm Red, 572nm Green, 470nm Blue LED Indication - Discrete 1.9V Red, 2V Green, 3.4V Blue 4-SMD, No Lead; DIGIKEY_PART_NUMBER: 516-2232-1-ND; LEAD_FREE: yes; MF: Broadcom; MOUSER_PART_NUMBER: 630-HSMF-C113; MPN: HSMF-C113; PACKAGE: SMT_LED_2MM5_1MM0; PREFIX: D; REVERSE_VOLTAGE: 5V; ROHS: yes; TEMPERATURE_RANGE_HIGH: +85°C; TEMPERATURE_RANGE_LOW: -40°C
D2 = ON_Semi-1N914BWS:ON_SEMI_1N914BWS: Diode Standard 75V 150mA Surface Mount SOD-323F; CENTROID_NOT_SPECIFIED: No; CURRENT_-_AVERAGE_RECTIFIED_(IO): 150mA; DATASHEET: https://www.fairchildsemi.com/datasheets/1N/1N914BWS.pdf; DIGIKEY_DESCRIPTION: Diode Standard 75V 150mA Surface Mount SOD-323F; DIGIKEY_PART_NUMBER: 1N914BWSCT-ND; LEAD_FREE: yes; MF: ON Semi; MOUSER_PART_NUMBER: 512-1N914BWS; MPN: 1N914BWS; PACKAGE: SOD-323F2L; PREFIX: D; ROHS: yes; TEMPERATURE_RANGE_HIGH: +150°C; VOLTAGE_-_DC_REVERSE_(VR)_(MAX): 75V
D3-D7 = adafruit:DIODE: Diode SMADIODE - SMA Surface Mount Package 20V 1A Schottky Diode Digikey: 641-1014-6-ND DO-1N4148 - Through Hole Small Current Diode SOD-123 20V 1 A (.5mV Vf) Schottky Diode - Digikey: MBRX120TPMSCT-ND SOD-323 10V 570mA (.38mV Vf, 3ns) Schottky Diode - Digikey: ZLLS410CT-ND SOD-523 30V 30mA Schottky Diode (RB751S-40TE61) - Digikey: RB751S-40TE61CT-ND SOT23-R/W - SOT23 Package (R = Solder Paste/Reflow Ovens, W = Hand-Soldering) BAT54Film 40V 300mA - Digikey: 497-7162-1-ND
D8-D10 = ESD-Diode_On-Semi-ESD5Z5.0T1G:ON_SEMICONDUCTOR_ESD5Z5.0T1G: ONSC-K1A2-2; CIIVA_IDS: 284485; COMPONENT_LINK_1_DESCRIPTION: Manufacturer URL; COMPONENT_LINK_1_URL: http://www.onsemi.com/; COMPONENT_LINK_3_DESCRIPTION: Package Specification; COMPONENT_LINK_3_URL: http://www.onsemi.com/pub_link/Collateral/502-01.PDF; DATASHEET: http://www.onsemi.cn/pub_link/Collateral/ESD5Z2.5T1-D.PDF; DATASHEET_VERSION: Rev. 10; DIRECTION: Unidirectional; FOOTPRINT_VARIANT_NAME_0: Manufacturer Recommended; IMPORTED: yes; IMPORTED_FROM: vault; IMPORT_TS: 1521842713; IR_MAX_UA: 0.05; MF: On Semiconductor; MOUNTING_TECHNOLOGY: Surface Mount; MPN: ESD5Z5.0T1G; NUMBER_OF_LINES: 1; PACKAGE: SOD-523-2-502-01; PACKAGE_DESCRIPTION: 2-Pin SOD, Body 1.2 x 0.8 mm; PACKAGE_VERSION: Rev. E, 09/2010; PACKING: Tape and Reel; PPK_MAX_W: 174; PREFIX: D; RELEASE_DATE: 1407165284; ROHS: No; VAULT_GUID: 2E60F141-7E89-4DCC-B1D9-9638F7D41C5F; VAULT_REVISION: 3E28F6AD-A77D-4A2F-8313-20A51EDFA349; VBR_MIN_V: 6.2; VRWM_MAX_V: 5
DOWN_SW UP_SW = E-Switch-TL3315NF160Q:E-SWITCH_TL3315NF160Q: SWITCH TACTILE SPST-NO 0.05A 15V; CENTROID_NOT_SPECIFIED: No; DATASHEET: http://media.digikey.com/pdf/Data%20Sheets/E-Switch%20PDFs/TL3315.pdf; DIGIKEY_DESCRIPTION: SWITCH TACTILE SPST-NO 0.05A 15V; DIGIKEY_PART_NUMBER: EG4621CT-ND; LEAD_FREE: yes; MF: E-Switch; MOUSER_PART_NUMBER: 612-TL3315NF160Q; MPN: TL3315NF160Q; PACKAGE: SW_SMT_4MM5_4MM5; PREFIX: SW; ROHS: yes; TEMPERATURE_RANGE_HIGH: +70°C; TEMPERATURE_RANGE_LOW: -20°C
G1 = APX80xx:APX809S: APX809S and its variants (voltages and SA/SR).
IC2 = texas:TPS6300*: HIGH EFFICIENT SINGLE INDUCTOR BUCK-BOOST CONVERTER WITH 1.8-A SWITCHES Source: http://focus.ti.com/lit/ds/symlink/tps63001.pdf; MPN: TPS63000DRCTG4; OC_FARNELL: 1511852; OC_NEWARK: 59M7217
J2 = microSD-socket-HIROSE-DM3BT-DSF-PEJS:HIROSE_DM3BT-DSF-PEJS: Right Angle Surface Mount Micro SD Card Connector, with Solder Termination; CENTROID_NOT_SPECIFIED: No; CONN_ORIENTATION: Right Angle; CONTACT_MATERIAL: Gold; CURRENT_RATING: 0.5A; DATASHEET: https://www.hirose.com/product/en/download_file/key_name/DM3/category/Catalog/doc_file_id/49662/?file_category_id=4&item_id=195&is_series=1; DEVICE_CLASS_L1: Connectors; DEVICE_CLASS_L2: Memory Connectors; DEVICE_CLASS_L3: unset; DIGIKEY_DESCRIPTION: CONN MICRO SD CARD PUSH-PUSH R/A; DIGIKEY_PART_NUMBER: HR1942CT-ND; FOOTPRINT_URL: https://www.hirose.com/product/en/download_file/key_name/DM3BT-DSF-PEJS/category/Drawing%20(2D)/doc_file_id/44097/?file_category_id=6&item_id=06090029900&is_series=; HEIGHT: 2.38mm; IS_FEMALE: yes; LEAD_FREE: yes; MEMORY_TYPE: FLASH; MF: HIROSE; MFG_PACKAGE_IDENT: DM3BT-DSF-PEJS; MFG_PACKAGE_IDENT_DATE: 0; MFG_PACKAGE_IDENT_REV: 0; MOUSER_DESCRIPTION: Memory Card Connectors MICRO SD CD CONN REV SMT PUSHPUSH; MOUSER_PART_NUMBER: 798-DM3BT-DSF-PEJS; MPN: DM3BT-DSF-PEJS; NUMBER_OF_CONTACTS: 8; PACKAGE: CONN_SMT_MICROSD_13MM85_16MM05; PREFIX: J; ROHS: yes; SHIELDING: true; TEMPERATURE_RANGE_HIGH: +85°C; TEMPERATURE_RANGE_LOW: -25°C; VERIFICATION_VERSION: 0.0.0.1; VOLTAGE_RATING: 125V
J3 = USB-C_Molex-105450-0101:MOLEX_105450-0101: USB - C USB 3.1, Superspeed+ Receptacle Connector 24 Position Surface Mount, Right Angle; Through Hole; CENTROID_NOT_SPECIFIED: No; CONTACT_FINISH: Gold; CURRENT_RATING: 0.25A, 1A, 5A; DATASHEET: http://www.molex.com/pdm_docs/sd/1054500101_sd.pdf; DESCRIPTION: USB - C USB 3.1, Superspeed+ Receptacle Connector 24 Position Surface Mount, Right Angle; Through Hole; DIGIKEY_DESCRIPTION: CONN RCPT USB C 3.1 SMT R/A; DIGIKEY_PART_NUMBER: WM12856CT-ND; IS_FEMALE: yes; LEAD_FREE: yes; MATING_CYCLES: 10000; MF: Molex; MOUSER_PART_NUMBER: 538-105450-0101; MPN: 105450-0101; NUMBER_OF_PORTS: 1; PACKAGE: CONN_SMT_8MM94_7MM9_USB; PREFIX: J; ROHS: yes; SHIELDING: Shielded; TEMPERATURE_RANGE_HIGH: +85°C; TEMPERATURE_RANGE_LOW: -30°C; VOLTAGE_-_RATED: 30VAC/DC
J12 = TRRS-Jack-SJ-43515TS-SMT:SJ-43515TS-SMT: 4 conductor 3.5 mm Surface Mount Audio Jack w/ Tip Switch; AVAILABILITY: Unavailable; DESCRIPTION: 4 conductor 3.5 mm Surface Mount Audio Jack w/ Tip Switch; MF: CUI; MP: SJ-43515TS-SMT; PACKAGE: None; PRICE: None
JL = CP2102N-A02-GQFN28:CP2102N-A02-GQFN28: CP2102N-A02-GQFN28 as per it's datasheet <https://www.silabs.com/documents/public/data-sheets/cp2102n-datasheet.pdf>.
LEFT_SW RIGHT_SW = E-Switch-TL3315NF160Q:E-SWITCH_TL3315NF160Q: SWITCH TACTILE SPST-NO 0.05A 15V; CENTROID_NOT_SPECIFIED: No; DATASHEET: http://media.digikey.com/pdf/Data%20Sheets/E-Switch%20PDFs/TL3315.pdf; DIGIKEY_DESCRIPTION: SWITCH TACTILE SPST-NO 0.05A 15V; DIGIKEY_PART_NUMBER: EG4621CT-ND; LEAD_FREE: yes; MF: E-Switch; MOUSER_PART_NUMBER: 612-TL3315NF160Q; MPN: TL3315NF160Q; PACKAGE: SW_SMT_4MM5_4MM5; PREFIX: SW; ROHS: yes; SPICEPREFIX: E; TEMPERATURE_RANGE_HIGH: +70°C; TEMPERATURE_RANGE_LOW: -20°C
Q1 Q3 = semicon-smd-ipc:NPN-TRANSISTOR_: NPN TRANSISTOR
Q2 = ON_Semi-MMBT5551LT1G:ON_SEMI_MMBT5551LT1G: Trans GP BJT NPN 160V 0.06A Automotive 3-Pin SOT-23 T/R; 3DS_PART_NUMBER: 452-00001; CENTROID_NOT_SPECIFIED: No; COLLECTOR_BASE_VOLTAGE: 180V; COLLECTOR_EMITTER_BREAKDOWN_VOLTAGE: 160V; COLLECTOR_EMITTER_SATURATION_VOLTAGE: 0.2V; COLLECTOR_EMITTER_VOLTAGE: 160V; DATASHEET: http://www.onsemi.com/pub/Collateral/MMBT5550LT1-D.PDF; DEVICE_CLASS_L1: Discrete Semiconductors; DEVICE_CLASS_L2: Transistors; DEVICE_CLASS_L3: BJTs; DIGIKEY_DESCRIPTION: TRANS NPN 160V 0.6A SOT23; DIGIKEY_PART_NUMBER: MMBT5551LT1GOSCT-ND; EMITTER_BASE_VOLTAGE: 6V; FOOTPRINT_PARAMETERS_1: {"fp_type":"SOT23","params":{"N":{"default":"3","long name":"Number of leads","type":"multichoice","short name":"N"},"A":{"nom":1000000,"long name":"Height","min":890000,"max":1110000,"short name":"A","type":"measurement"},"A1":{"nom":60000,"long name":"Package clearance","min":10000,"max":100000,"short name":"A1","type":"measurement"},"A2":{"nom":940000,"long name":"Package height","min":880000,"max":1010000,"short name":"A2","type":"measurement"},"D":{"nom":2900000,"long name":"Package length","min":2800000,"max":3040000,"short name":"D","type":"measurement"},"E":{"nom":2400000,"long name":"Width /w leads","min":2100000,"max":2640000,"short name":"E","type":"measurement"},"E1":{"nom":1300000,"long name":"Package width","min":1200000,"max":1400000,"short name":"E1","type":"measurement"},"B":{"nom":440000,"long name":"Lead width","min":370000,"max":500000,"short name":"B","type":"measurement"},"C":{"nom":140000,"long name":"Lead thickness","min":80000,"max":200000,"short name":"C","type":"measurement"},"L":{"nom":430000,"long name":"Lead foot length","min":300000,"max":550000,"short name":"L","type":"measurement"},"e":{"nom":950000,"long name":"Lead pitch","min":null,"max":null,"short name":"e","type":"measurement"},"PHI":{"nom":false,"long name":"Lead angle","min":0,"max":10000000,"short name":"PHI","type":"measurement"},"offset x":{"nom":0,"long name":"X Center offset","min":null,"max":null,"short name":"offset x","type":"measurement"},"offset y":{"nom":0,"long name":"Y Center offset","min":null,"max":null,"short name":"offset y","type":"measurement"},"LS":{"default":"Rounded rectangle","long name":"Land shape","type":"multichoice","short name":"LS"},"LS1":{"default":"Rectangle","long name":"Land shape (Pin 1)","type":"multichoice","short name":"LS1"},"solder toe":{"nom":550000,"long name":"Solder fillet (toe)","min":null,"max":null,"short name":"solder toe","type":"fixedmeasurement"},"solder heel":{"nom":450000,"long name":"Solder fillet (heel)","min":null,"max":null,"short name":"solder heel","type":"fixedmeasurement"},"solder side":{"nom":50000,"long name":"Solder fillet (side)","min":null,"max":null,"short name":"solder side","type":"fixedmeasurement"},"courtyard":{"nom":500000,"long name":"Courtyard","min":null,"max":null,"short name":"courtyard","type":"fixedmeasurement"},"SF":{"default":"A","long name":"Packing level","type":"multichoiceparent","short name":"SF","help":"http://support.upverter.com/customer/portal/articles/978783-what-is-a-footprint-packing-level","children":["solder toe","solder heel","solder side","courtyard"]}}}; FOOTPRINT_PARAMETERS_2: {"fp_type":"SOT23","params":{"N":{"default":"3","long name":"Number of leads","type":"multichoice","short name":"N"},"A":{"nom":1000000,"long name":"Height","min":890000,"max":1110000,"short name":"A","type":"measurement"},"A1":{"nom":60000,"long name":"Package clearance","min":10000,"max":100000,"short name":"A1","type":"measurement"},"A2":{"nom":940000,"long name":"Package height","min":880000,"max":1010000,"short name":"A2","type":"measurement"},"D":{"nom":2900000,"long name":"Package length","min":2800000,"max":3040000,"short name":"D","type":"measurement"},"E":{"nom":2400000,"long name":"Width /w leads","min":2100000,"max":2640000,"short name":"E","type":"measurement"},"E1":{"nom":1300000,"long name":"Package width","min":1200000,"max":1400000,"short name":"E1","type":"measurement"},"B":{"nom":440000,"long name":"Lead width","min":370000,"max":500000,"short name":"B","type":"measurement"},"C":{"nom":140000,"long name":"Lead thickness","min":80000,"max":200000,"short name":"C","type":"measurement"},"L":{"nom":430000,"long name":"Lead foot length","min":300000,"max":550000,"short name":"L","type":"measurement"},"e":{"nom":950000,"long name":"Lead pitch","min":null,"max":null,"short name":"e","type":"measurement"},"PHI":{"nom":false,"long name":"Lead angle","min":0,"max":10000000,"short name":"PHI","type":"measurement"},"offset x":{"nom":0,"long name":"X Center offset","min":null,"max":null,"short name":"offset x","type":"measurement"},"offset y":{"nom":0,"long name":"Y Center offset","min":null,"max":null,"short name":"offset y","type":"measurement"},"LS":{"default":"Rounded rectangle","long name":"Land shape","type":"multichoice","short name":"LS"},"LS1":{"default":"Rectangle","long name":"Land shape (Pin 1)","type":"multichoice","short name":"LS1"},"solder toe":{"nom":350000,"long name":"Solder fillet (toe)","min":null,"max":null,"short name":"solder toe","type":"fixedmeasurement"},"solder heel":{"nom":350000,"long name":"Solder fillet (heel)","min":null,"max":null,"short name":"solder heel","type":"fixedmeasurement"},"solder side":{"nom":30000,"long name":"Solder fillet (side)","min":null,"max":null,"short name":"solder side","type":"fixedmeasurement"},"courtyard":{"nom":250000,"long name":"Courtyard","min":null,"max":null,"short name":"courtyard","type":"fixedmeasurement"},"SF":{"default":"B","long name":"Packing level","type":"multichoiceparent","short name":"SF","help":"http://support.upverter.com/customer/portal/articles/978783-what-is-a-footprint-packing-level","children":["solder toe","solder heel","solder side","courtyard"]}}}; FOOTPRINT_PARAMETERS_3: {"fp_type":"SOT23","params":{"N":{"default":"3","long name":"Number of leads","type":"multichoice","short name":"N"},"A":{"nom":1000000,"long name":"Height","min":890000,"max":1110000,"short name":"A","type":"measurement"},"A1":{"nom":60000,"long name":"Package clearance","min":10000,"max":100000,"short name":"A1","type":"measurement"},"A2":{"nom":940000,"long name":"Package height","min":880000,"max":1010000,"short name":"A2","type":"measurement"},"D":{"nom":2900000,"long name":"Package length","min":2800000,"max":3040000,"short name":"D","type":"measurement"},"E":{"nom":2400000,"long name":"Width /w leads","min":2100000,"max":2640000,"short name":"E","type":"measurement"},"E1":{"nom":1300000,"long name":"Package width","min":1200000,"max":1400000,"short name":"E1","type":"measurement"},"B":{"nom":440000,"long name":"Lead width","min":370000,"max":500000,"short name":"B","type":"measurement"},"C":{"nom":140000,"long name":"Lead thickness","min":80000,"max":200000,"short name":"C","type":"measurement"},"L":{"nom":430000,"long name":"Lead foot length","min":300000,"max":550000,"short name":"L","type":"measurement"},"e":{"nom":950000,"long name":"Lead pitch","min":null,"max":null,"short name":"e","type":"measurement"},"PHI":{"nom":false,"long name":"Lead angle","min":0,"max":10000000,"short name":"PHI","type":"measurement"},"offset x":{"nom":0,"long name":"X Center offset","min":null,"max":null,"short name":"offset x","type":"measurement"},"offset y":{"nom":0,"long name":"Y Center offset","min":null,"max":null,"short name":"offset y","type":"measurement"},"LS":{"default":"Rounded rectangle","long name":"Land shape","type":"multichoice","short name":"LS"},"LS1":{"default":"Rectangle","long name":"Land shape (Pin 1)","type":"multichoice","short name":"LS1"},"solder toe":{"nom":150000,"long name":"Solder fillet (toe)","min":null,"max":null,"short name":"solder toe","type":"fixedmeasurement"},"solder heel":{"nom":250000,"long name":"Solder fillet (heel)","min":null,"max":null,"short name":"solder heel","type":"fixedmeasurement"},"solder side":{"nom":10000,"long name":"Solder fillet (side)","min":null,"max":null,"short name":"solder side","type":"fixedmeasurement"},"courtyard":{"nom":100000,"long name":"Courtyard","min":null,"max":null,"short name":"courtyard","type":"fixedmeasurement"},"SF":{"default":"C","long name":"Packing level","type":"multichoiceparent","short name":"SF","help":"http://support.upverter.com/customer/portal/articles/978783-what-is-a-footprint-packing-level","children":["solder toe","solder heel","solder side","courtyard"]}}}; FOOTPRINT_URL: http://www.onsemi.com/pub/Collateral/318-08.PDF; FOOTPRINT_VARIANT_NAME_0: Recommended_Land_Pattern; FOOTPRINT_VARIANT_NAME_1: IPC_A; FOOTPRINT_VARIANT_NAME_2: IPC_B; FOOTPRINT_VARIANT_NAME_3: IPC_C; HEIGHT: 1.11mm; HFE_MIN: 80; IPC_LAND_PATTERN_NAME: SOT95P240X100-3; LEAD_FREE: yes; MAX_COLLECTOR_CURRENT: 600mA; MAX_JUNCTION_TEMP: +150°C; MF: ON Semi; MFG_PACKAGE_IDENT: 318-08; MFG_PACKAGE_IDENT_DATE: 01/2018; MFG_PACKAGE_IDENT_REV: AS; MOUSER_PART_NUMBER: 863-MMBT5551LT1G; MPN: MMBT5551LT1G; NUMBER_OF_ELEMENTS: 1; NUMBER_OF_NPN: 1; NUMBER_OF_PNP: 0; PACKAGE: SOT-23 (TO-236); POWER_DISSIPATION: 225mW; PREFIX: Q; ROHS: yes; STANDOFF_HEIGHT: 0.01mm; TEMPERATURE_RANGE_HIGH: +150°C; TEMPERATURE_RANGE_LOW: -55°C; VERIFICATION_VERSION: 0.0.0.1
R1-R55 = rcl:R-US_: RESISTOR, American symbol; SPICEPREFIX: R
TPS6224 = TPS62240:TPS62240
U1 = vlsi-web-e7:VS1053: Ogg Vorbis / MP3 / AAC / WMA / FLAC / MIDI Audio Codec Chip
U2 = Microchip-MCP73831T-2ATI:MICROCHIP_MCP73831T-2ATI-OT: PM-BM-MCP73831-SOT5; CIIVA_IDS: 961386; CODE__IPC: SOT23-5; DATASHEET_VERSION: revE, Sep-2008; FOOTPRINT_VARIANT_NAME_0: Level C; FOOTPRINT_VARIANT_NAME_1: Level B; FOOTPRINT_VARIANT_NAME_2: Level A; IMPORTED: yes; IMPORTED_FROM: vault; IMPORT_TS: 1521858219; MF: Microchip; MPN: MCP73831T-2ATI/OT; PACKAGE: SOT-23-OT5; PACKAGE_DESCRIPTION: 5-Lead Plastic Small Outline Transistor (OT) [SOT-23]; PACKAGE_VERSION: revBB, Aug-2009; PREFIX: U; RELEASE_DATE: 1300334172; VAULT_GUID: 2E16BB74-376E-4BA5-8468-379BB32F6F4F; VAULT_REVISION: 08CA403F-6CAA-4AD2-9BA5-F14A59377F17
U$1 = ESP32:ESP32-PICO
U$2 = TOSHIBA_NAND-GATE:TOSHIBA-NAND-GATE
U$3 = VLF4012:VLS4012
U$4 = Crystal:ECS12P88MHZ
U$5 = CR43NP-4R7MC:CR43NP-2R2MC
U$6 = AT42QT2120:COMMS-AT42QT2120
U$7 = L-0402:L-0402
X3 = con-hirose:FH12-45S-0.5S: 0.5mm Pitch Connectors For FPC/FFC Source: Data sheet <http://www.hirose.co.jp/cataloge_hp/e58605370.pdf>; OC_FARNELL: unknown; OC_NEWARK: unknown